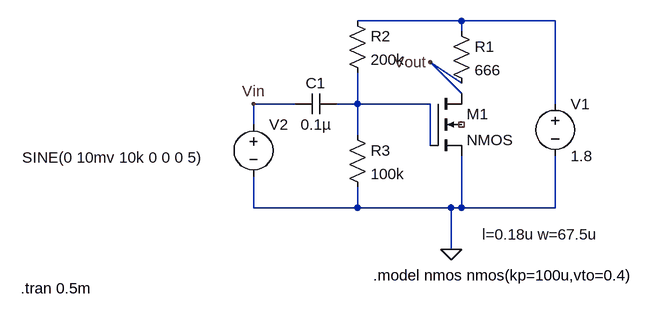
[diagram p0: schematic CS Core with Biasing.asc]
CS Core with Biasing.asc, the LTspice schematic file:
Version 4
SHEET 1 880 680
WIRE 272 16 112 16
WIRE 416 16 272 16
WIRE 272 32 272 16
WIRE 272 112 224 80
WIRE 272 128 224 80
WIRE 16 144 -48 144
WIRE 112 144 112 96
WIRE 112 144 80 144
WIRE 224 144 112 144
WIRE 416 144 416 16
WIRE -48 176 -48 144
WIRE 112 192 112 144
WIRE 224 208 224 144
WIRE -48 304 -48 256
WIRE 112 304 112 272
WIRE 112 304 -48 304
WIRE 256 304 112 304
WIRE 272 304 272 224
WIRE 272 304 256 304
WIRE 416 304 416 224
WIRE 416 304 272 304
WIRE 256 368 256 304
FLAG 256 368 0
FLAG -48 144 Vin
FLAG 224 80 Vout
SYMBOL voltage 416 128 R0
WINDOW 123 0 0 Left 0
WINDOW 39 0 0 Left 0
SYMATTR InstName V1
SYMATTR Value 1.8
SYMBOL res 96 0 R0
SYMATTR InstName R2
SYMATTR Value 200k
SYMBOL res 96 176 R0
SYMATTR InstName R3
SYMATTR Value 100k
SYMBOL cap 80 128 R90
WINDOW 0 0 32 VBottom 2
WINDOW 3 32 32 VTop 2
SYMATTR InstName C1
SYMATTR Value 0.1µ
SYMBOL nmos4 224 128 R0
WINDOW 123 80 217 Left 2
SYMATTR InstName M1
SYMATTR Value2 l=0.18u w=67.5u
SYMBOL res 256 16 R0
SYMATTR InstName R1
SYMATTR Value 666
SYMBOL voltage -48 160 R0
WINDOW 3 -356 67 Left 2
WINDOW 123 0 0 Left 0
WINDOW 39 0 0 Left 0
SYMATTR InstName V2
SYMATTR Value SINE(0 10mv 10k 0 0 0 5)
TEXT 136 408 Left 2 !.model nmos nmos(kp=100u,vto=0.4)
TEXT -406 428 Left 2 !.tran 0.5m

The netlist it stands for:
* CS Core with Biasing.asc
V1 N001 0 1.8
R2 N001 N002 200k
R3 N002 0 100k
C1 N002 Vin 0.1µ
M1 Vout N002 0 NC_01 NMOS l=0.18u w=67.5u
R1 N001 Vout 666
V2 Vin 0 SINE(0 10mv 10k 0 0 0 5)
.model NMOS NMOS
.model PMOS PMOS
.lib standard.mos
.model nmos nmos(kp=100u,vto=0.4)
.tran 0.5m
.backanno
.end